# EAGLE design PXO_1_0 (EAGLE 8.3.2)
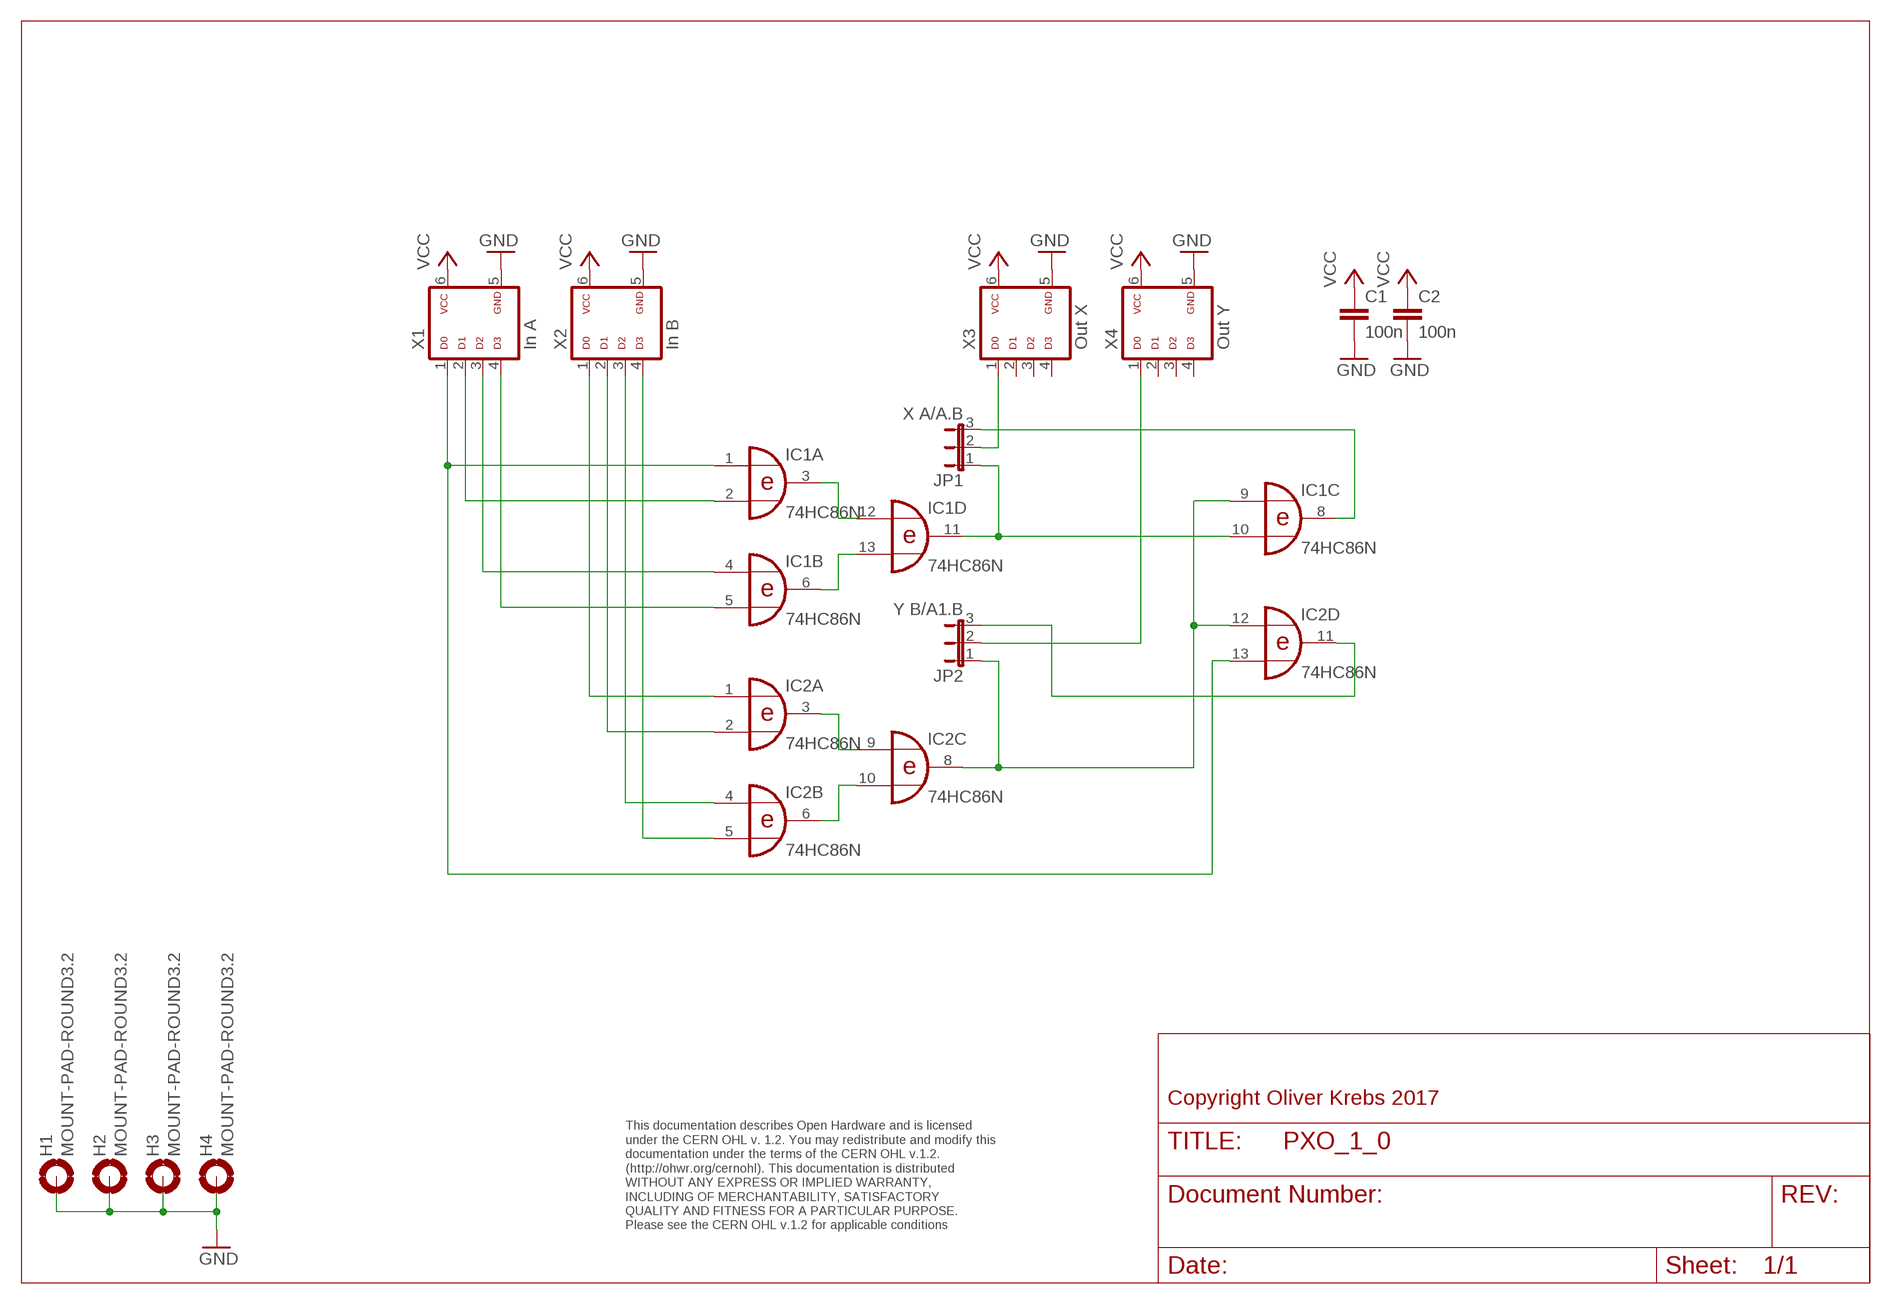
[diagram p0: schematic, sheet 1]

## Parts
C1  100n  C-EU050-025X075  [C050-025X075]
C2  100n  C-EU050-025X075  [C050-025X075]
H1  MOUNT-PAD-ROUND3.2  [3,2-PAD]
H2  MOUNT-PAD-ROUND3.2  [3,2-PAD]
H3  MOUNT-PAD-ROUND3.2  [3,2-PAD]
H4  MOUNT-PAD-ROUND3.2  [3,2-PAD]
IC1  74HC86N  [DIL14]
IC2  74HC86N  [DIL14]
JP1  X A/A.B  JP2EJP2-U  [JP2-U]
JP2  Y B/A1.B  JP2EJP2-U  [JP2-U]
X1  In A  ML6D  [ML-6]
X2  In B  ML6D  [ML-6]
X3  Out X  ML6D  [ML-6]
X4  Out Y  ML6D  [ML-6]

## Nets
GND: C1.2 C2.2 H1.B3,2(MOUNT) H2.B3,2(MOUNT) H3.B3,2(MOUNT) H4.B3,2(MOUNT) X1.5 X2.5 X3.5 X4.5
N$1: IC1.1(A:I0) IC2.13(D:I1) X1.1
N$2: IC1.4(B:I0) X1.3
N$3: IC1.3(A:O) IC1.12(D:I0)
N$4: IC1.5(B:I1) X1.4
N$5: IC1.2(A:I1) X1.2
N$6: IC1.6(B:O) IC1.13(D:I1)
N$7: IC1.10(C:I1) IC1.11(D:O) JP1.1
N$8: IC2.1(A:I0) X2.1
N$9: IC2.2(A:I1) X2.2
N$10: IC2.4(B:I0) X2.3
N$11: IC2.5(B:I1) X2.4
N$12: IC2.3(A:O) IC2.9(C:I0)
N$13: IC2.6(B:O) IC2.10(C:I1)
N$14: IC1.9(C:I0) IC2.8(C:O) IC2.12(D:I0) JP2.1
N$15: JP1.2 X3.1
N$16: IC1.8(C:O) JP1.3
N$17: IC2.11(D:O) JP2.3
N$18: JP2.2 X4.1
VCC: C1.1 C2.1 X1.6 X2.6 X3.6 X4.6
Unconnected: X3.2 X3.3 X3.4 X4.2 X4.3 X4.4

## Notes on the sheet
- Copyright Oliver Krebs 2017
- This documentation describes Open Hardware and is licensed 
  under the CERN OHL v. 1.2. You may redistribute and modify this 
  documentation under the terms of the CERN OHL v.1.2. 
  (http://ohwr.org/cernohl). This documentation is distributed
  WITHOUT ANY EXPRESS OR IMPLIED WARRANTY, 
  INCLUDING OF MERCHANTABILITY, SATISFACTORY 
  QUALITY AND FITNESS FOR A PARTICULAR PURPOSE. 
  Please see the CERN OHL v.1.2 for applicable conditions

## Power pins joined to a net without a drawn wire
GND: IC1.7(P:GND) IC2.7(P:GND)
VCC: IC1.14(P:VCC) IC2.14(P:VCC)

## Library data of the parts
C1 C2 = 01-my_rcl:C-EU: CAPACITOR, European symbol
H1-H4 = holes:MOUNT-PAD-ROUND: MOUNTING PAD, round
IC1 IC2 = 74xx-eu:74*86: Quad 2-input EXCLUSIVE-OR (XOR) gate
JP1 JP2 = 01-my-jumper:JP2E: JUMPER
X1-X4 = 01-my-con:ML6D

## Board
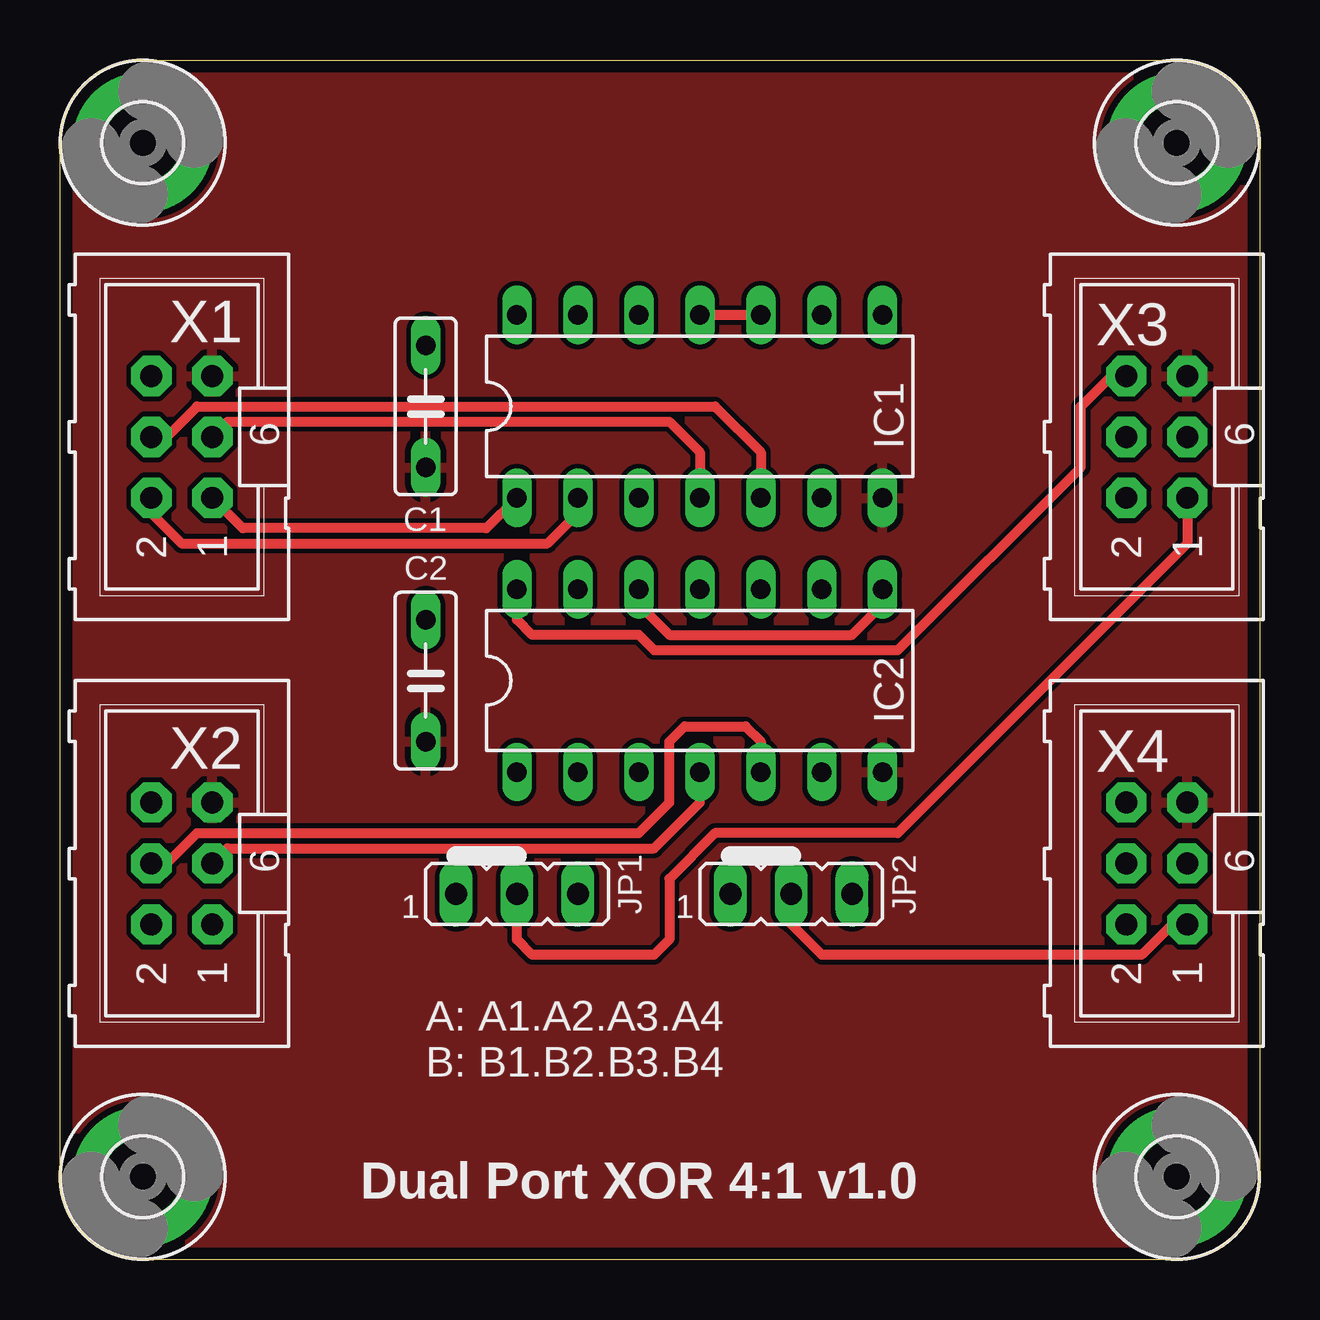
[diagram p1: board, top side]
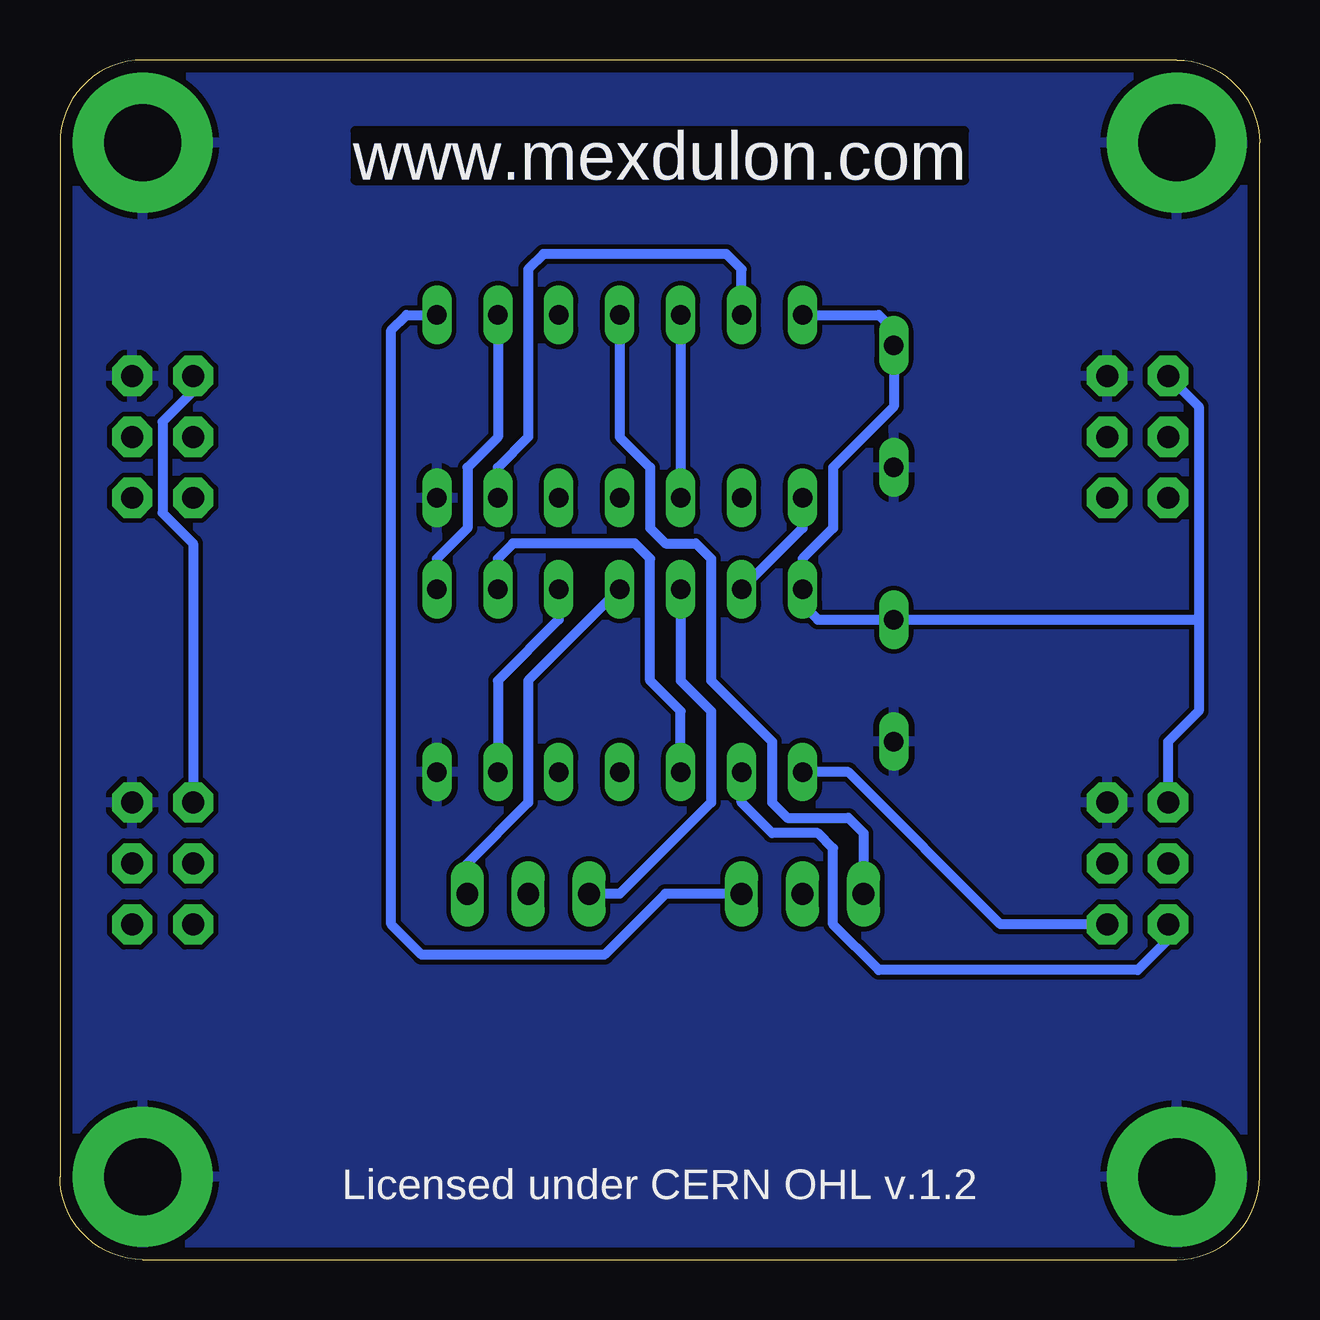
[diagram p2: board, bottom side, seen from below]

Size 50 x 50 mm. Coordinates in mm from the lower left corner, seen from the top.
Outline: 0,3.45 0,46.55 arc-90 3.45,50 46.55,50 arc-90 50,46.55 50,3.45 arc-90 46.55,0 3.45,0 arc-90 0,3.45
Copper layers (1*16): Top 0.035mm / dielectric 1.6mm / Bottom 0.035mm
Design rules "Elecrow_2-layer_PCB_eagle_rule": minimum track width 6mil, minimum drill 12mil, track to track 6mil, track to pad 6mil, pad to pad 6mil, via to via 8mil, smd to smd 0mil, copper to edge 20mil, drill to drill 10mil, minimum pad ring 6mil, minimum via ring 6mil, stop-mask expansion 0mil, vias tented up to drill 100mil, thermal gap 10mil

### Footprints (pad centres in the part's own frame; a part is rotated, then mirrored left to right if it is on the bottom)
C050-025X075 = drill 0.813 long: 1 -2.54,0; 2 2.54,0
3,2-PAD = drill 3.2 pad 5.842: B3,2 0,0
DIL14 = drill 0.813 long: 1 -7.62,-3.81; 2 -5.08,-3.81; 3 -2.54,-3.81; 4 0,-3.81; 5 2.54,-3.81; 6 5.08,-3.81; 7 7.62,-3.81; 8 7.62,3.81; 9 5.08,3.81; 10 2.54,3.81; 11 0,3.81; 12 -2.54,3.81; 13 -5.08,3.81; 14 -7.62,3.81
JP2-U = drill 0.914 long: 1 -2.54,0; 2 0,0; 3 2.54,0
ML-6 = drill 0.914 pad 1.676 octagon: 1 -2.54,-1.27; 2 -2.54,1.27; 3 0,-1.27; 4 0,1.27; 5 2.54,-1.27; 6 2.54,1.27

### Placement (x,y rotation side)
C1  15.24,35.56 270 top
C2  15.24,24.13 270 top
H1  3.45,3.45 0 top
H2  3.45,46.55 0 top
H3  46.55,46.55 0 top
H4  46.55,3.45 0 top
IC1  26.67,35.56 0 top
IC2  26.67,24.13 0 top
JP1  19.05,15.24 0 top
JP2  30.48,15.24 0 top
X1  5.08,34.29 90 top
X2  5.08,16.51 90 top
X3  45.72,34.29 90 top
X4  45.72,16.51 90 top

### Tracks (layer width: path | path; a pad name or v marks a point on that pad's centre or on a via)
GND
  pour Bottom (isolate 0.203): 0,50.16 50.8,50.16 50.8,0 0,0
  pour Top (isolate 0.203): 0,50.16 50.8,50.16 50.8,0 0,0
N$1
  Top 0.406: IC1.1 17.78,30.48 7.62,30.48 X1.1
  Bottom 0.406: IC1.1 19.05,30.48 IC2.13
N$2
  Top 0.406: X1.3 6.99,34.92 25.4,34.92 26.67,33.66 IC1.4
N$3
  Bottom 0.406: IC1.12 IC1.3
N$4
  Top 0.406: X1.4 4.45,34.29 5.71,35.56 27.3,35.56 29.21,33.66 IC1.5
N$5
  Top 0.406: X1.2 3.81,31.11 5.08,29.84 20.32,29.84 21.59,31.11 IC1.2
N$6
  Bottom 0.406: IC1.13 21.59,41.27 22.23,41.91 29.84,41.91 30.48,41.27 30.48,34.29 31.75,33.02 IC1.6
N$7
  Top 0.406: IC1.10 IC1.11
  Bottom 0.406: IC1.11 26.67,34.29 25.4,33.02 25.4,30.48 24.77,29.84 23.5,29.84 22.86,29.21 22.86,24.13 20.32,21.59 20.32,19.05 19.68,18.41 17.14,18.41 16.51,17.78 JP1.1
N$8
  Bottom 0.406: X2.1 10.79,13.97 17.14,20.32 IC2.1
N$9
  Bottom 0.406: X2.2 3.81,13.34 5.08,12.06 15.88,12.06 17.78,13.97 17.78,17.14 18.41,17.78 20.32,17.78 21.59,19.05 IC2.2
N$10
  Top 0.406: X2.3 6.99,17.14 24.77,17.14 26.67,19.05 IC2.4
N$11
  Top 0.406: X2.4 4.45,16.51 5.71,17.78 24.13,17.78 25.4,19.05 25.4,21.59 26.04,22.23 28.57,22.23 29.21,21.59 IC2.5
N$12
  Bottom 0.406: IC2.3 24.13,22.86 25.4,24.13 25.4,29.21 26.04,29.84 31.11,29.84 31.75,29.21 IC2.9
N$13
  Bottom 0.406: IC2.10 29.21,26.67 31.75,24.13 IC2.6
N$14
  Top 0.406: IC2.12 24.13,27.3 25.4,26.04 33.02,26.04 34.29,27.3 IC2.8
  Bottom 0.406: IC2.12 24.13,24.13 22.86,22.86 22.86,19.05 26.67,15.24 JP2.1 | IC1.9 31.75,34.29 33.02,33.02 33.02,30.48 34.29,29.21 IC2.8
N$15
  Top 0.406: X3.1 46.99,29.84 34.92,17.78 27.3,17.78 25.4,15.88 25.4,13.34 24.77,12.7 19.68,12.7 19.05,13.34 JP1.2
N$16
  Bottom 0.406: JP1.3 24.77,15.24 27.3,12.7 34.92,12.7 36.2,13.97 36.2,38.73 35.56,39.37 IC1.8
N$17
  Bottom 0.406: IC2.11 30.48,24.13 30.48,19.05 33.02,16.51 JP2.3
N$18
  Top 0.406: X4.1 46.35,13.97 45.09,12.7 31.75,12.7 30.48,13.97 JP2.2
VCC
  Top 0.406: IC2.14 19.05,26.67 19.68,26.04 24.13,26.04 24.77,25.4 34.92,25.4 42.55,33.02 42.55,35.56 43.81,36.83 X3.6
  Bottom 0.406: X3.6 44.45,36.2 45.72,34.92 45.72,31.11 44.45,29.84 X4.6 | X2.6 3.81,21.59 2.54,22.86 2.54,26.67 | X1.6 2.54,35.56 2.54,26.67 | IC1.14 15.88,39.37 15.24,38.73 C1.1 15.24,35.56 17.78,33.02 17.78,30.48 19.05,29.21 IC2.14 19.05,27.3 18.41,26.67 C2.1 2.54,26.67

### Text on the board
Bottom: www.mexdulon.com
tNames: A: A1.A2.A3.A4 / B: B1.B2.B3.B4 | Dual Port XOR 4:1 v1.0
bNames: www.mexdulon.com | Licensed under CERN OHL v.1.2
200bmp: E:/Bilder/Elektronik/Modulion/Mexdulon/mexdulon_50x50_pcb.bmp